# Altium schematic sheet CAN Splitter.SchDoc
size 127 x 127 mm
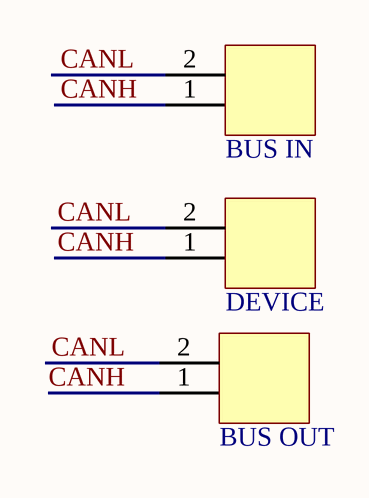
[diagram p0: CAN Splitter.SchDoc]

## Parts
BUS_IN  2-pin Horz Sherlock  [MOLEX-HDR-1X2-SHERLOCK-HORZ]  (value not drawn)
BUS_OUT  2-pin Horz Sherlock  [MOLEX-HDR-1X2-SHERLOCK-HORZ]  (value not drawn)
DEVICE  2-pin Horz Sherlock  [MOLEX-HDR-1X2-SHERLOCK-HORZ]  (value not drawn)

## Nets
CANH: BUS_IN.1 BUS_OUT.1 DEVICE.1
CANL: BUS_IN.2 BUS_OUT.2 DEVICE.2

## Notes on the sheet
- Title
- Size:
- Date:
- A
- Number:
- Time:
- Revision:
- Sheet
- of
- File:

## Library data of the parts
BUS_IN BUS_OUT DEVICE = MOLEX-HDR-1x2-SHERLOCK_RA: Header, Molex, 2mm Pitch Sherlock Header, Single Row, Horizontal, 2 Circuits, Length 3.3mm,  0353630260; Manufacturer: Molex Inc; Manufacturer Part Number: 0353630260; Supplier Part Number 1: WM18931-ND; Supplier 1: Digi-Key